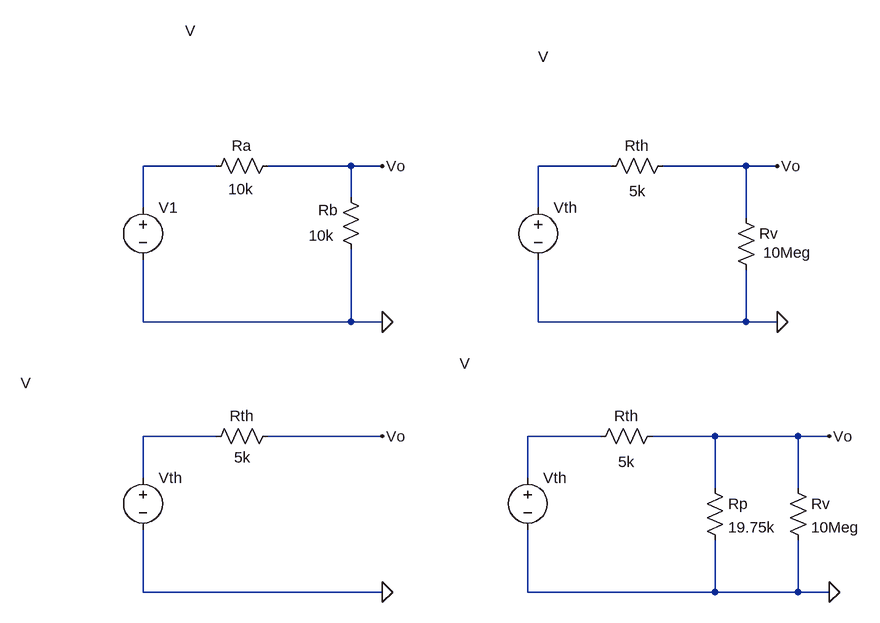
[diagram p0: schematic Draft1.asc]
Draft1.asc, the LTspice schematic file:
Version 4
SHEET 1 1092 772
WIRE 96 96 -16 96
WIRE 304 96 176 96
WIRE 352 96 304 96
WIRE 704 96 592 96
WIRE 912 96 784 96
WIRE 960 96 912 96
WIRE 304 144 304 96
WIRE -16 160 -16 96
WIRE 592 160 592 96
WIRE 912 176 912 96
WIRE -16 336 -16 240
WIRE 304 336 304 224
WIRE 304 336 -16 336
WIRE 352 336 304 336
WIRE 592 336 592 240
WIRE 912 336 912 256
WIRE 912 336 592 336
WIRE 960 336 912 336
WIRE 96 512 -16 512
WIRE 352 512 176 512
WIRE 688 512 576 512
WIRE 864 512 768 512
WIRE 992 512 864 512
WIRE 1040 512 992 512
WIRE -16 576 -16 512
WIRE 576 576 576 512
WIRE 864 592 864 512
WIRE 992 592 992 512
WIRE -16 752 -16 656
WIRE 352 752 -16 752
WIRE 576 752 576 656
WIRE 864 752 864 672
WIRE 864 752 576 752
WIRE 992 752 992 672
WIRE 992 752 864 752
WIRE 1040 752 992 752
FLAG 352 336 0
FLAG 352 96 Vo
FLAG 352 512 Vo
FLAG 352 752 0
FLAG 960 96 Vo
FLAG 960 336 0
FLAG 1040 512 Vo
FLAG 1040 752 0
SYMBOL res 192 80 R90
WINDOW 0 0 56 VBottom 2
WINDOW 3 36 57 VTop 2
SYMATTR InstName Ra
SYMATTR Value 10k
SYMBOL res 320 240 R180
WINDOW 0 36 76 Left 2
WINDOW 3 42 37 Left 2
SYMATTR InstName Rb
SYMATTR Value 10k
SYMBOL voltage -16 144 R0
WINDOW 3 65 -256 Left 2
SYMATTR InstName V1
SYMBOL res 192 496 R90
WINDOW 0 0 56 VBottom 2
WINDOW 3 33 55 VTop 2
SYMATTR InstName Rth
SYMATTR Value 5k
SYMBOL voltage -16 560 R0
WINDOW 3 -188 -130 Left 2
SYMATTR InstName Vth
SYMBOL res 800 80 R90
WINDOW 0 0 56 VBottom 2
WINDOW 3 39 55 VTop 2
SYMATTR InstName Rth
SYMATTR Value 5k
SYMBOL voltage 592 144 R0
WINDOW 3 0 -216 Left 2
SYMATTR InstName Vth
SYMBOL res 896 160 R0
WINDOW 3 42 69 Left 2
SYMATTR InstName Rv
SYMATTR Value 10Meg
SYMBOL res 784 496 R90
WINDOW 0 0 56 VBottom 2
WINDOW 3 40 56 VTop 2
SYMATTR InstName Rth
SYMATTR Value 5k
SYMBOL voltage 576 560 R0
WINDOW 3 -105 -160 Left 2
SYMATTR InstName Vth
SYMBOL res 976 576 R0
SYMATTR InstName Rv
SYMATTR Value 10Meg
SYMBOL res 848 576 R0
SYMATTR InstName Rp
SYMATTR Value 19.75k

The netlist it stands for:
* Draft1.asc
Ra Vo N001 10k
Rb 0 Vo 10k
V1 N001 0 V
Rth Vo N003 5k
Vth N003 0 V
Rth Vo N002 5k
Vth N002 0 V
Rv Vo 0 10Meg
Rth Vo N004 5k
Vth N004 0 V
Rv Vo 0 10Meg
Rp Vo 0 19.75k
.backanno
.end